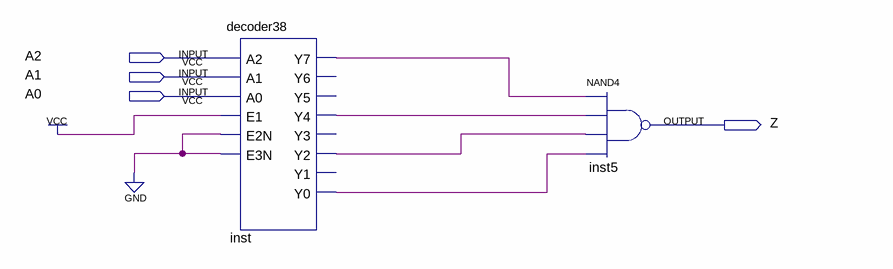
[diagram p0: schematic sheet]
// Quartus schematic exp_3.bdf as structural Verilog: 2 symbols, 4 pins
module exp_3 (
  input  A2,
  input  A1,
  input  A0,
  output Z
);

  wire inst_y0, inst_y2, inst_y4, inst_y7;

  decoder38 inst (
    .A2(A2), .A1(A1), .A0(A0), .E1(1'b1), .E2N(1'b0), .E3N(1'b0), .Y7(inst_y7), .Y4(inst_y4), .Y2(inst_y2),
    .Y0(inst_y0));  // open: Y6, Y5, Y3, Y1
  nand inst5 (Z, inst_y7, inst_y4, inst_y2, inst_y0);
endmodule
